# EAGLE design Schematic (EAGLE 9.4.2)

## Sheet 1 of 3: Power
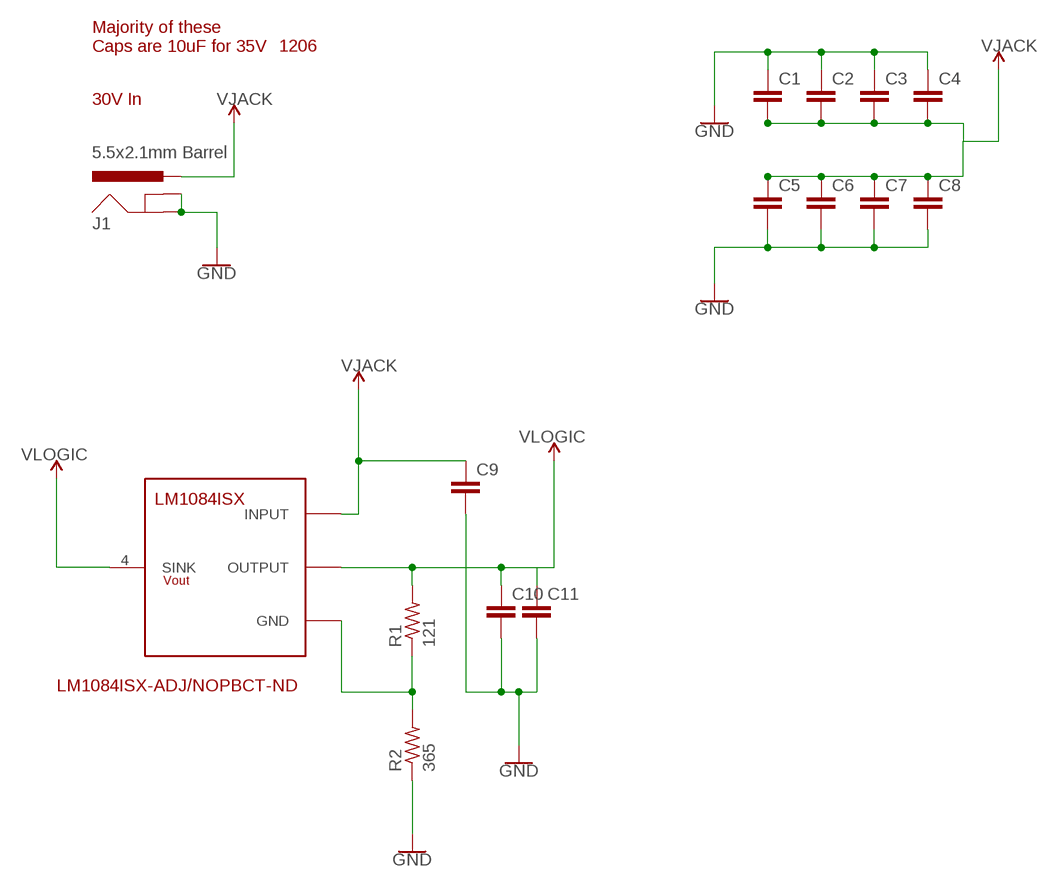
[diagram p0: schematic, sheet 1]

### Parts
C1  C-EUC1206K  [C1206K]
C2  C-EUC1206K  [C1206K]
C3  C-EUC1206K  [C1206K]
C4  C-EUC1206K  [C1206K]
C5  C-EUC1206K  [C1206K]
C6  C-EUC1206K  [C1206K]
C7  C-EUC1206K  [C1206K]
C8  C-EUC1206K  [C1206K]
C9  C-EUC1206K  [C1206K]
C10  C-EUC1206K  [C1206K]
C11  C-EUC1206K  [C1206K]
J1  5.5x2.1mm Barrel  POWER_JACKSMD  [POWER_JACK_SMD]
R1  121  R-US_R0805  [R0805]
R2  365  R-US_R0805  [R0805]
U$2  LM1084ISX  [TO254P1435X464-4N]

### Nets
GND: C1.1 C2.1 C3.1 C4.1 C5.2 C6.2 C7.2 C8.2 C9.2 C10.2 C11.2 J1.GND(GNDBREAK) J1.P$4(GND) R2.1 ; also sheet 2,3
N$1: R1.1 R2.2 U$2.1(GND)
VJACK: C1.2 C2.2 C3.2 C4.2 C5.1 C6.1 C7.1 C8.1 C9.1 J1.VIN0(PWR) U$2.3(INPUT) ; supply symbol labelled VCC ; also sheet 3
VLOGIC: C10.1 C11.1 R1.2 U$2.2(OUTPUT) U$2.4(SINK) ; supply symbol labelled VCC ; also sheet 2,3

### Notes on the sheet
- Majority of these
  Caps are 10uF for 35V
- 1206
- 30V In
- LM1084ISX-ADJ/NOPBCT-ND

## Sheet 2 of 3: Logic
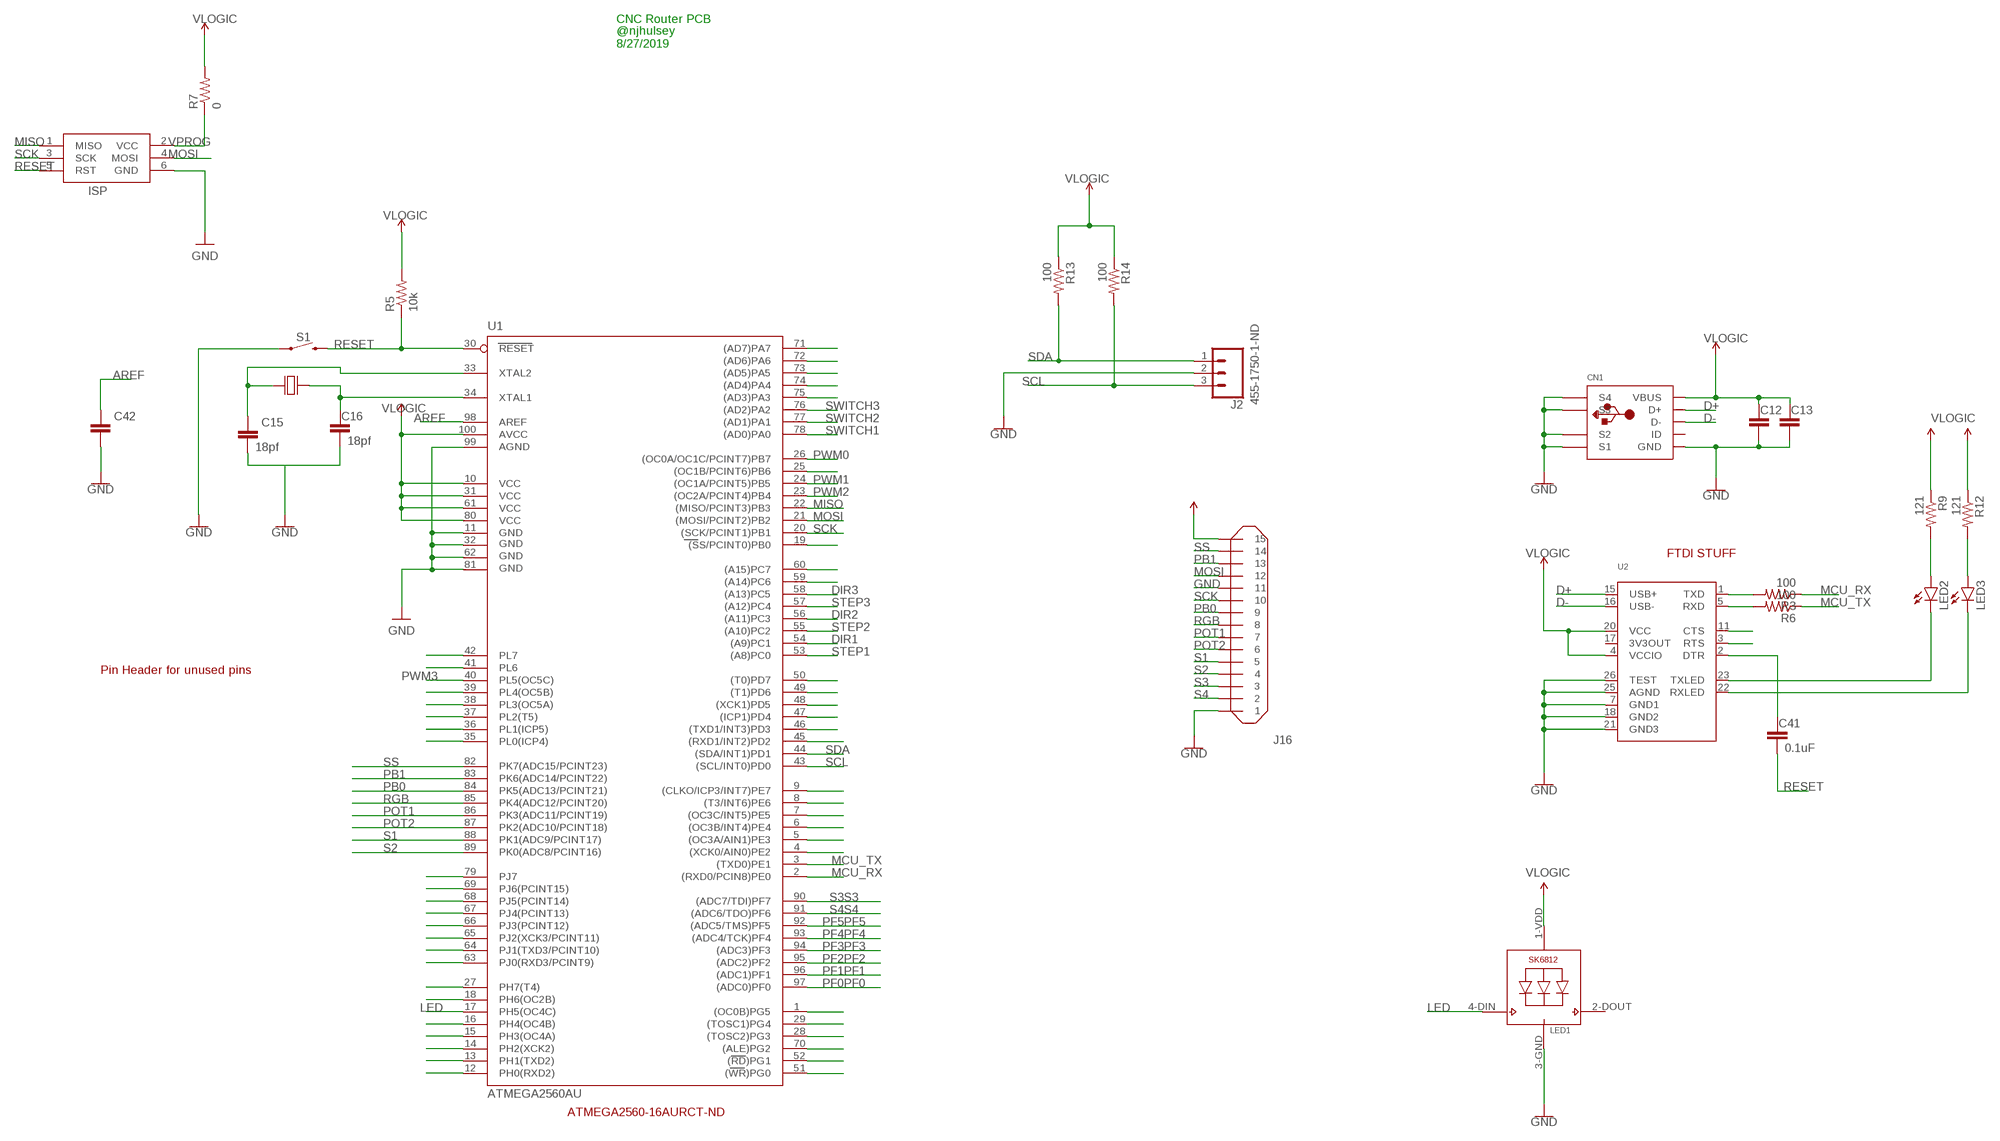
[diagram p1: schematic, sheet 2]

### Parts
C12  C-EUC0805  [C0805]
C13  C-EUC0805  [C0805]
C15  18pf  C-EUC0805  [C0805]
C16  18pf  C-EUC0805  [C0805]
C41  0.1uF  C-EUC0805  [C0805]
C42  C-EUC0805  [C0805]
CN1  USBMINIBLARGE  [USB-MINIB_LARGER]
ISP  AVRISP-6  [AVRISP]
J2  455-1750-1-ND  CONN_03  [1X03]
J16  MOLEX-15-FFC-VERT  [MOLEX-VERT-FFC-15]
LED1  SK6812_5050  [LED5050]
LED2  LEDCHIPLED_0805  [CHIPLED_0805]
LED3  LEDCHIPLED_0805  [CHIPLED_0805]
R3  100  R-US_R0805  [R0805]
R5  10k  R-US_R0805  [R0805]
R6  100  R-US_R0805  [R0805]
R7  0  R-US_R0805  [R0805]
R9  121  R-US_R0805  [R0805]
R12  121  R-US_R0805  [R0805]
R13  100  R-US_R0805  [R0805]
R14  100  R-US_R0805  [R0805]
S1  MOMENTARY-SWITCH-SPST-SMD-5.2-REDUNDANT  [TACTILE_SWITCH_SMD_5.2MM]
U1  ATMEGA2560AU  [TQFP100]
U2  FT232RLSSOP28  [SSOP28DB]
U$1  CRYSTAL-SMD-HC-49US  [CRYSTAL_SMD_HC-49/US]

### Nets
AREF: C42.1 U1.98(AREF)
D+: CN1.D+ U2.15(USB+)
D-: CN1.D- U2.16(USB-)
DIR1: U1.54((A9)PC1) ; also sheet 3
DIR2: U1.56((A11)PC3) ; also sheet 3
DIR3: U1.58((A13)PC5) ; also sheet 3
GND: C12.2 C13.2 C15.2 C16.2 C42.2 CN1.GND CN1.GND1(S1) CN1.GND2(S2) CN1.GND3(S3) CN1.GND4(S4) ISP.6(GND) J2.2 J16.P$1 J16.P$2 J16.P$21 J16.P$22 LED1.3-GND(GND) S1.1 S1.2 U1.11(GND) U1.32(GND1) U1.62(GND2) U1.81(GND3) U1.99(AGND) U2.7(GND1) U2.18(GND2) U2.21(GND3) U2.25(AGND) U2.26(TEST) ; also sheet 1,3
LED: LED1.4-DIN(DI) U1.17(PH5(OC4C))
MCU_RX: R3.1 U1.2((RXD0/PCIN8)PE0)
MCU_TX: R6.1 U1.3((TXD0)PE1)
MISO: ISP.1(MISO) U1.22((MISO/PCINT3)PB3)
MOSI: ISP.4(MOSI) J16.P$23 J16.P$24 U1.21((MOSI/PCINT2)PB2)
N$2: LED2.A R9.2
N$5: U1.5((OC3A/AIN1)PE3)
N$6: LED3.A R12.2
N$7: U1.45((RXD1/INT2)PD2)
N$9: U1.46((TXD1/INT3)PD3)
N$10: R3.2 U2.1(TXD)
N$11: R6.2 U2.5(RXD)
N$12: U2.11(CTS)
N$13: U2.3(RTS)
N$14: C41.1 U2.2(DTR)
N$15: LED2.C U2.23(TXLED)
N$16: LED3.C U2.22(RXLED)
N$17: U1.79(PJ7)
N$91: C15.1 U1.33(XTAL2) U$1.P$2
N$92: C16.1 U1.34(XTAL1) U$1.P$1
N$93: U1.12(PH0(RXD2))
N$94: U1.13(PH1(TXD2))
N$95: U1.14(PH2(XCK2))
N$96: U1.15(PH3(OC4A))
N$97: U1.16(PH4(OC4B))
N$99: U1.18(PH6(OC2B))
N$100: U1.27(PH7(T4))
N$101: U1.63(PJ0(RXD3/PCINT9))
N$102: U1.64(PJ1(TXD3/PCINT10))
N$103: U1.65(PJ2(XCK3/PCINT11))
N$104: U1.66(PJ3(PCINT12))
N$105: U1.67(PJ4(PCINT13))
N$106: U1.68(PJ5(PCINT14))
N$107: U1.69(PJ6(PCINT15))
N$117: U1.35(PL0(ICP4))
N$118: U1.36(PL1(ICP5))
N$119: U1.37(PL2(T5))
N$120: U1.38(PL3(OC5A))
N$121: U1.39(PL4(OC5B))
N$123: U1.41(PL6)
N$124: U1.42(PL7)
N$125: U1.71((AD7)PA7)
N$126: U1.72((AD6)PA6)
N$127: U1.73((AD5)PA5)
N$128: U1.74((AD4)PA4)
N$129: U1.75((AD3)PA3)
N$134: U1.25((OC1B/PCINT6)PB6)
N$137: U1.19((SS/PCINT0)PB0)
N$138: U1.60((A15)PC7)
N$139: U1.59((A14)PC6)
N$146: U1.50((T0)PD7)
N$147: U1.49((T1)PD6)
N$148: U1.48((XCK1)PD5)
N$149: U1.47((ICP1)PD4)
N$152: U1.9((CLKO/ICP3/INT7)PE7)
N$153: U1.8((T3/INT6)PE6)
N$154: U1.7((OC3C/INT5)PE5)
N$155: U1.6((OC3B/INT4)PE4)
N$157: U1.4((XCK0/AIN0)PE2)
N$168: U1.1((OC0B)PG5)
N$169: U1.29((TOSC1)PG4)
N$170: U1.28((TOSC2)PG3)
N$171: U1.70((ALE)PG2)
N$172: U1.52((RD)PG1)
N$173: U1.51((WR)PG0)
PB0: J16.P$17 J16.P$18 U1.84(PK5(ADC13/PCINT21))
PB1: J16.P$25 J16.P$26 U1.83(PK6(ADC14/PCINT22))
PF0: U1.97((ADC0)PF0)
PF1: U1.96((ADC1)PF1)
PF2: U1.95((ADC2)PF2)
PF3: U1.94((ADC3)PF3)
PF4: U1.93((ADC4/TCK)PF4)
PF5: U1.92((ADC5/TMS)PF5)
POT1: J16.P$13 J16.P$14 U1.86(PK3(ADC11/PCINT19))
POT2: J16.P$11 J16.P$12 U1.87(PK2(ADC10/PCINT18))
PWM0: U1.26((OC0A/OC1C/PCINT7)PB7) ; also sheet 3
PWM1: U1.24((OC1A/PCINT5)PB5) ; also sheet 3
PWM2: U1.23((OC2A/PCINT4)PB4) ; also sheet 3
PWM3: U1.40(PL5(OC5C)) ; also sheet 3
RESET: C41.2 ISP.5(RST) R5.1 S1.3 S1.4 U1.30(RESET)
RGB: J16.P$15 J16.P$16 U1.85(PK4(ADC12/PCINT20))
S1: J16.P$9 J16.P$10 U1.88(PK1(ADC9/PCINT17))
S2: J16.P$7 J16.P$8 U1.89(PK0(ADC8/PCINT16))
S3: J16.P$5 J16.P$6 U1.90((ADC7/TDI)PF7)
S4: J16.P$3 J16.P$4 U1.91((ADC6/TDO)PF6)
SCK: ISP.3(SCK) J16.P$19 J16.P$20 U1.20((SCK/PCINT1)PB1)
SCL: J2.3 R14.2 U1.43((SCL/INT0)PD0)
SDA: J2.1 R13.2 U1.44((SDA/INT1)PD1)
SS: J16.P$27 J16.P$28 U1.82(PK7(ADC15/PCINT23))
STEP1: U1.53((A8)PC0) ; also sheet 3
STEP2: U1.55((A10)PC2) ; also sheet 3
STEP3: U1.57((A12)PC4) ; also sheet 3
SWITCH1: U1.78((AD0)PA0) ; also sheet 3
SWITCH2: U1.77((AD1)PA1) ; also sheet 3
SWITCH3: U1.76((AD2)PA2) ; also sheet 3
VCC: J16.P$29 J16.P$30
VLOGIC: C12.1 C13.1 CN1.VBUS LED1.1-VDD(VDD) R5.2 R7.2 R9.1 R12.1 R13.1 R14.1 U1.10(VCC) U1.31(VCC1) U1.61(VCC2) U1.80(VCC3) U1.100(AVCC) U2.4(VCCIO) U2.20(VCC) ; supply symbol labelled VCC ; also sheet 1,3
VPROG: ISP.2(VCC) R7.1
Unconnected: CN1.ID LED1.2-DOUT(DO)

### Notes on the sheet
- CNC Router PCB
- @njhulsey
  8/27/2019
- FTDI STUFF
- Pin Header for unused pins
- ATMEGA2560-16AURCT-ND

## Sheet 3 of 3: Devices
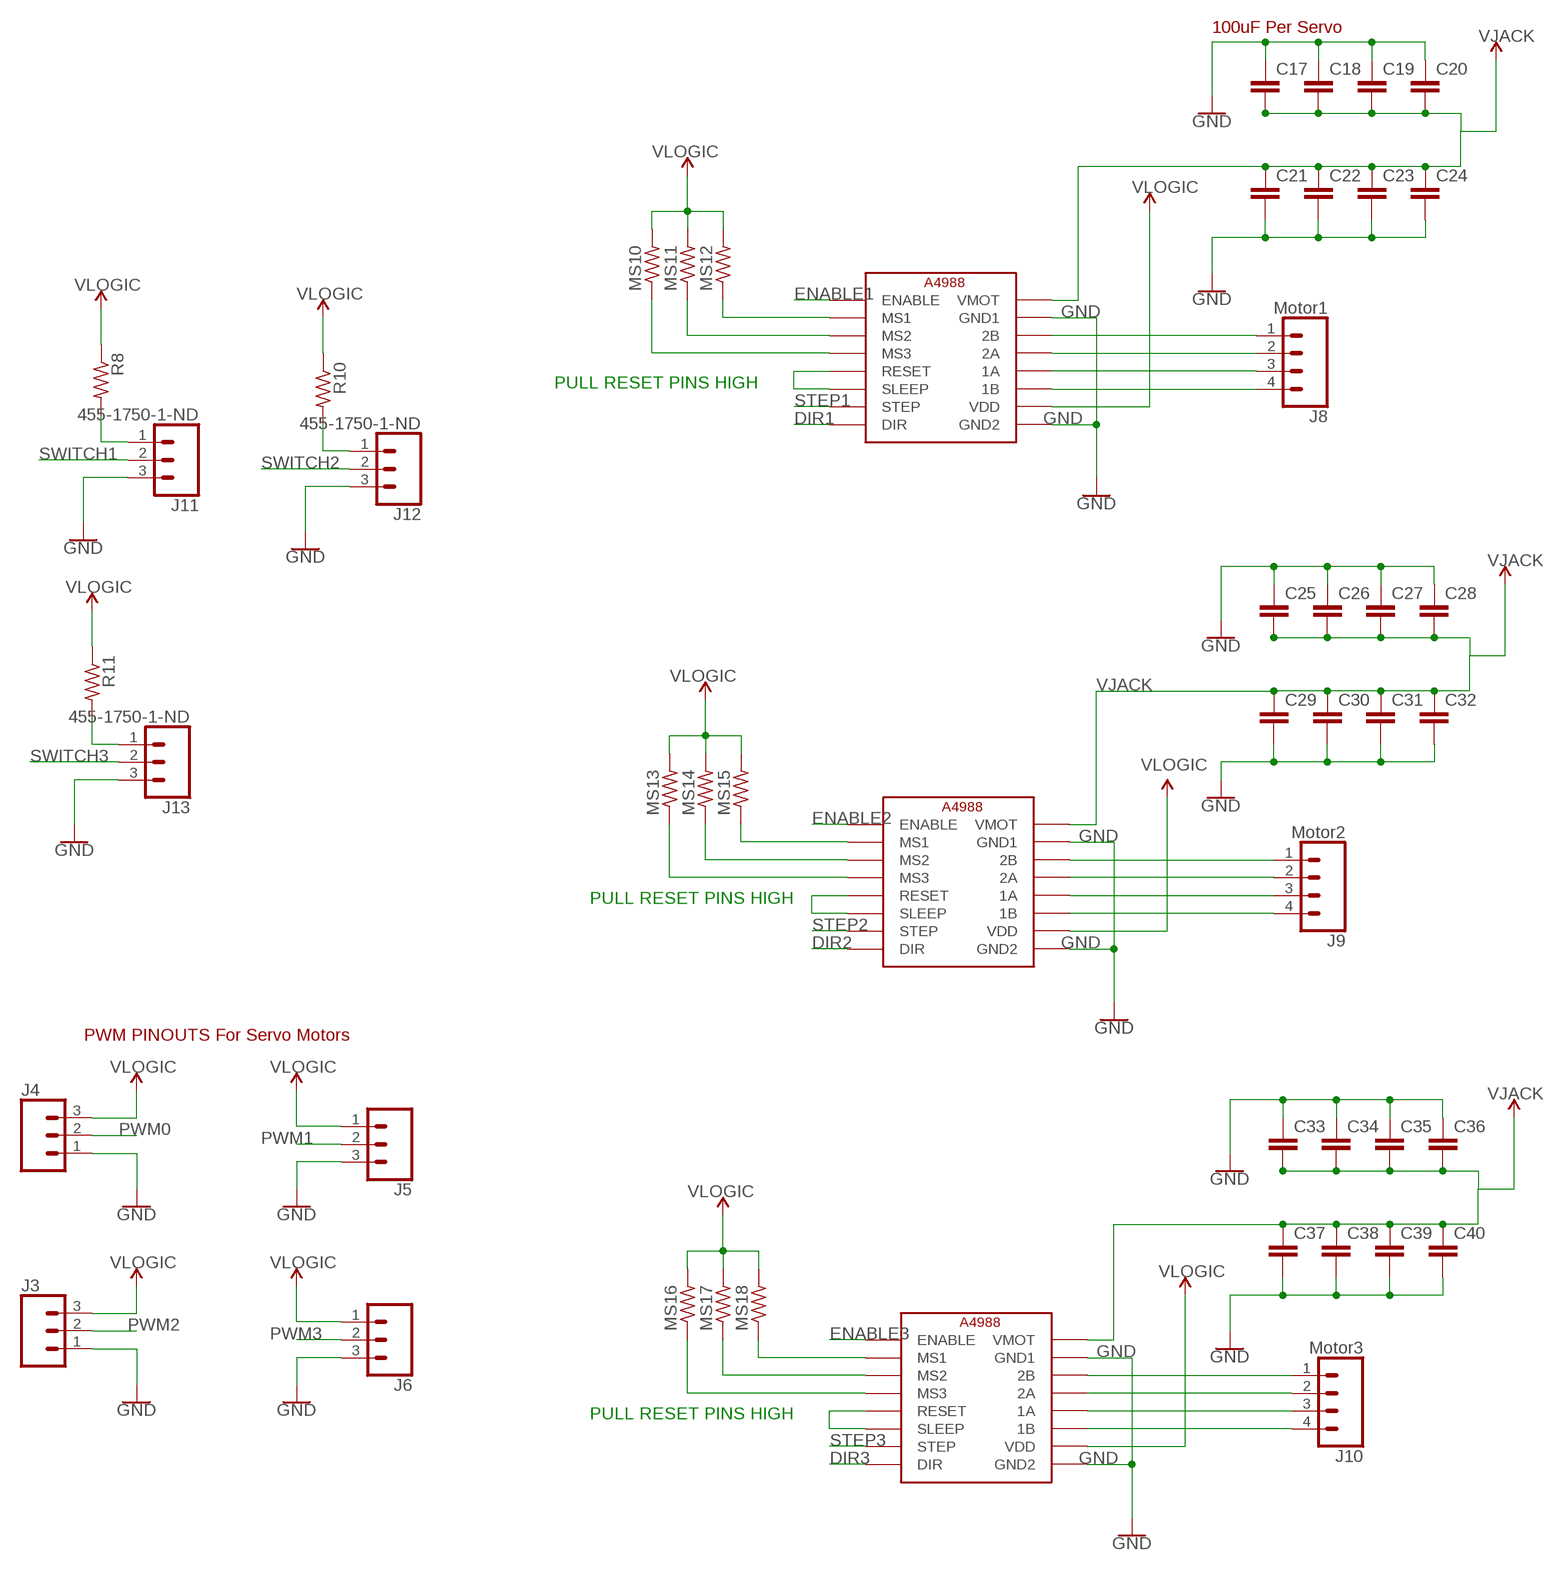
[diagram p2: schematic, sheet 3]

### Parts
C17  C-EUC1206K  [C1206K]
C18  C-EUC1206K  [C1206K]
C19  C-EUC1206K  [C1206K]
C20  C-EUC1206K  [C1206K]
C21  C-EUC1206K  [C1206K]
C22  C-EUC1206K  [C1206K]
C23  C-EUC1206K  [C1206K]
C24  C-EUC1206K  [C1206K]
C25  C-EUC1206K  [C1206K]
C26  C-EUC1206K  [C1206K]
C27  C-EUC1206K  [C1206K]
C28  C-EUC1206K  [C1206K]
C29  C-EUC1206K  [C1206K]
C30  C-EUC1206K  [C1206K]
C31  C-EUC1206K  [C1206K]
C32  C-EUC1206K  [C1206K]
C33  C-EUC1206K  [C1206K]
C34  C-EUC1206K  [C1206K]
C35  C-EUC1206K  [C1206K]
C36  C-EUC1206K  [C1206K]
C37  C-EUC1206K  [C1206K]
C38  C-EUC1206K  [C1206K]
C39  C-EUC1206K  [C1206K]
C40  C-EUC1206K  [C1206K]
DRVER_4  Driver1  A4988  [A4988]
DRVER_5  Driver1  A4988  [A4988]
DRVER_6  Driver1  A4988  [A4988]
J3  455-1750-1-ND  CONN_03  [1X03]
J4  455-1750-1-ND  CONN_03  [1X03]
J5  455-1750-1-ND  CONN_03  [1X03]
J6  455-1750-1-ND  CONN_03  [1X03]
J8  Motor1  CONN_04  [1X04]
J9  Motor2  CONN_04  [1X04]
J10  Motor3  CONN_04  [1X04]
J11  455-1750-1-ND  CONN_03  [1X03]
J12  455-1750-1-ND  CONN_03  [1X03]
J13  455-1750-1-ND  CONN_03  [1X03]
MS10  R-US_R0805  [R0805]
MS11  R-US_R0805  [R0805]
MS12  R-US_R0805  [R0805]
MS13  R-US_R0805  [R0805]
MS14  R-US_R0805  [R0805]
MS15  R-US_R0805  [R0805]
MS16  R-US_R0805  [R0805]
MS17  R-US_R0805  [R0805]
MS18  R-US_R0805  [R0805]
R8  R-US_R0805  [R0805]
R10  R-US_R0805  [R0805]
R11  R-US_R0805  [R0805]

### Nets
DIR1: DRVER_4.P$9(DIR) ; also sheet 2
DIR2: DRVER_5.P$9(DIR) ; also sheet 2
DIR3: DRVER_6.P$9(DIR) ; also sheet 2
ENABLE1: DRVER_4.P$16(ENABLE)
ENABLE2: DRVER_5.P$16(ENABLE)
ENABLE3: DRVER_6.P$16(ENABLE)
GND: C17.1 C18.1 C19.1 C20.1 C21.2 C22.2 C23.2 C24.2 C25.1 C26.1 C27.1 C28.1 C29.2 C30.2 C31.2 C32.2 C33.1 C34.1 C35.1 C36.1 C37.2 C38.2 C39.2 C40.2 DRVER_4.P$1(GND2) DRVER_4.P$7(GND1) DRVER_5.P$1(GND2) DRVER_5.P$7(GND1) DRVER_6.P$1(GND2) DRVER_6.P$7(GND1) J3.1 J4.1 J5.3 J6.3 J11.3 J12.3 J13.3 ; also sheet 1,2
N$3: J11.1 R8.2
N$4: J12.1 R10.2
N$8: J13.1 R11.2
N$18: DRVER_4.P$13(MS3) MS10.1
N$19: DRVER_4.P$14(MS2) MS11.1
N$20: DRVER_4.P$15(MS1) MS12.1
N$21: DRVER_4.P$3(1B) J8.4
N$22: DRVER_4.P$4(1A) J8.3
N$23: DRVER_4.P$5(2A) J8.2
N$24: DRVER_4.P$6(2B) J8.1
N$25: DRVER_6.P$13(MS3) MS16.1
N$26: DRVER_6.P$14(MS2) MS17.1
N$27: DRVER_6.P$15(MS1) MS18.1
N$28: DRVER_6.P$6(2B) J10.1
N$29: DRVER_6.P$5(2A) J10.2
N$30: DRVER_6.P$4(1A) J10.3
N$31: DRVER_6.P$3(1B) J10.4
N$32: DRVER_5.P$15(MS1) MS15.1
N$33: DRVER_5.P$14(MS2) MS14.1
N$34: DRVER_5.P$13(MS3) MS13.1
N$35: DRVER_5.P$6(2B) J9.1
N$36: DRVER_5.P$5(2A) J9.2
N$37: DRVER_5.P$4(1A) J9.3
N$38: DRVER_5.P$3(1B) J9.4
PWM0: J4.2 ; also sheet 2
PWM1: J5.2 ; also sheet 2
PWM2: J3.2 ; also sheet 2
PWM3: J6.2 ; also sheet 2
SLEEP3: DRVER_4.P$11(SLEEP) DRVER_4.P$12(RESET)
SLEEP4: DRVER_5.P$11(SLEEP) DRVER_5.P$12(RESET)
SLEEP5: DRVER_6.P$11(SLEEP) DRVER_6.P$12(RESET)
STEP1: DRVER_4.P$10(STEP) ; also sheet 2
STEP2: DRVER_5.P$10(STEP) ; also sheet 2
STEP3: DRVER_6.P$10(STEP) ; also sheet 2
SWITCH1: J11.2 ; also sheet 2
SWITCH2: J12.2 ; also sheet 2
SWITCH3: J13.2 ; also sheet 2
VJACK: C17.2 C18.2 C19.2 C20.2 C21.1 C22.1 C23.1 C24.1 C25.2 C26.2 C27.2 C28.2 C29.1 C30.1 C31.1 C32.1 C33.2 C34.2 C35.2 C36.2 C37.1 C38.1 C39.1 C40.1 DRVER_4.P$8(VMOT) DRVER_5.P$8(VMOT) DRVER_6.P$8(VMOT) ; supply symbol labelled VCC ; also sheet 1
VLOGIC: DRVER_4.P$2(VDD) DRVER_5.P$2(VDD) DRVER_6.P$2(VDD) J3.3 J4.3 J5.1 J6.1 MS10.2 MS11.2 MS12.2 MS13.2 MS14.2 MS15.2 MS16.2 MS17.2 MS18.2 R8.1 R10.1 R11.1 ; supply symbol labelled VCC ; also sheet 1,2

### Notes on the sheet
- 100uF Per Servo
- PULL RESET PINS HIGH
- PULL RESET PINS HIGH
- PWM PINOUTS For Servo Motors
- PULL RESET PINS HIGH

## Power pins joined to a net without a drawn wire
3V3OUT: U2.17(3V3OUT)

## Library data of the parts
C1-C13 C15-C42 = resistor:C-EU: CAPACITOR, European symbol
CN1 = microbuilder:USB: USB Connectors USBMINIB - Surface Mount Female Mini-B USB Connector 4UConnector: 06564
DRVER_4-DRVER_6 = Nick's Personal Part:A4988
ISP = adafruit:AVRISP: AVR ISP HEADER Standard 6 pin header for AVR programming
J1 = SparkFun-Connectors:POWER_JACK: Power Jack Connector This is the standard 5.5mm barrel jack for power. The PTH is the most common, proven, reliable, footprint. The Slot footprint only works if the mill layer is transmitted to the PCB fab house so be warned. Here are the connectors we sell at SparkFun: DC Barrel Power Jack/Connector <https://www.sparkfun.com/products/119> (PRT-00119) DC Barrel Power Jack/Connector (SMD) <https://www.sparkfun.com/products/12748> (PRT-12748) DC Barrel Jack Adapter - Breadboard Compatible <https://www.sparkfun.com/products/10811> (PRT-10811) It is used on this SparkFun product (and many, many others): SparkFun RedBoard - Programmed with Arduino <https://www.sparkfun.com/products/12757> (DEV-12757) Also, if you need a mating power supply or connector, please check these out: Wall Adapter Power Supply - 9VDC 650mA <https://www.sparkfun.com/products/298> (TOL-00298) DC Barrel Jack Adapter - Male <https://www.sparkfun.com/products/10287> (PRT-10287); PROD_ID: CONN-08106; SF_ID: PRT-12748
J2-J6 J11-J13 = SparkFun-Connectors:CONN_03: Multi connection point. Often used as Generic Header-pin footprint for 0.1 inch spaced/style header connections On any of the 0.1 inch spaced packages, you can populate with these: Break Away Headers - Straight <https://www.sparkfun.com/products/116> (PRT-00116) Break Away Male Headers - Right Angle <https://www.sparkfun.com/products/553> (PRT-00553) Female Headers <https://www.sparkfun.com/products/115> (PRT-00115) Break Away Headers - Machine Pin <https://www.sparkfun.com/products/117> (PRT-00117) Break Away Female Headers - Swiss Machine Pin <https://www.sparkfun.com/products/743> (PRT-00743) Stackable Header - 3 Pin (Female, 0.1") <https://www.sparkfun.com/products/13875> (PRT-13875) For SCREWTERMINALS and SPRING TERMINALS visit here: Screw Terimnals on SparkFun.com <https://www.sparkfun.com/search/results?term=Screw+Terminals> (5mm/3.5mm/2.54mm spacing) This device is also useful as a general connection point to wire up your design to another part of your project. Our various solder wires solder well into these plated through hole pads. Hook-Up Wire - Assortment (Stranded, 22 AWG) <https://www.sparkfun.com/products/11375> (PRT-11375) Hook-Up Wire - Assortment (Solid Core, 22 AWG) <https://www.sparkfun.com/products/11367> (PRT-11367) View the entire wire category on our website here <https://www.sparkfun.com/categories/141> Special notes: Molex polarized connector foot print use with SKU : PRT-08232 with associated crimp pins and housings.; PROD_ID: XXX-00000
J8-J10 = SparkFun-Connectors:CONN_04: Multi connection point. Often used as Generic Header-pin footprint for 0.1 inch spaced/style header connections On any of the 0.1 inch spaced packages, you can populate with these: Break Away Headers - Straight <https://www.sparkfun.com/products/116> (PRT-00116) Break Away Male Headers - Right Angle <https://www.sparkfun.com/products/553> (PRT-00553) Female Headers <https://www.sparkfun.com/products/115> (PRT-00115) Break Away Headers - Machine Pin <https://www.sparkfun.com/products/117> (PRT-00117) Break Away Female Headers - Swiss Machine Pin <https://www.sparkfun.com/products/743> (PRT-00743) For SCREWTERMINALS and SPRING TERMINALS visit here: Screw Terimnals on SparkFun.com <https://www.sparkfun.com/search/results?term=Screw+Terminals> (5mm/3.5mm/2.54mm spacing) This device is also useful as a general connection point to wire up your design to another part of your project. Our various solder wires solder well into these plated through hole pads. Hook-Up Wire - Assortment (Stranded, 22 AWG) <https://www.sparkfun.com/products/11375> (PRT-11375) Hook-Up Wire - Assortment (Solid Core, 22 AWG) <https://www.sparkfun.com/products/11367> (PRT-11367) View the entire wire category on our website here <https://www.sparkfun.com/categories/141> Special notes: Molex polarized connector foot print use with SKU : PRT-08231 with associated crimp pins and housings. 1MM SMD Version SKU: PRT-10208; PROD_ID: CONN-09696
J16 = Nick's Personal Part:MOLEX-15-FFC-VERT: 0526101572 - Molex Connector Technical Specifications: FFC Connector Pins: 15 Pitch: 1mm Type: Vertical Digikey: WM11008CT-ND Flex Cable: 100R15-152B
LED1 = SK6812:SK6812
LED2 LED3 = led:LED: LED OSRAM: - CHIPLED LG R971, LG N971, LY N971, LG Q971, LY Q971, LO R971, LY R971 LH N974, LH R974 LS Q976, LO Q976, LY Q976 LO Q996 - Hyper CHIPLED LW Q18S LB Q993, LB Q99A, LB R99A - SideLED LS A670, LO A670, LY A670, LG A670, LP A670 LB A673, LV A673, LT A673, LW A673 LH A674 LY A675 LS A676, LA A676, LO A676, LY A676, LW A676 LS A679, LY A679, LG A679 - Hyper Micro SIDELED® LS Y876, LA Y876, LO Y876, LY Y876 LT Y87S - SmartLED LW L88C, LW L88S LB L89C, LB L89S, LG L890 LS L89K, LO L89K, LY L89K LS L896, LA L896, LO L896, LY L896 - TOPLED LS T670, LO T670, LY T670, LG T670, LP T670 LSG T670, LSP T670, LSY T670, LOP T670, LYG T670 LG T671, LOG T671, LSG T671 LB T673, LV T673, LT T673, LW T673 LH T674 LS T676, LA T676, LO T676, LY T676, LB T676, LH T676, LSB T676, LW T676 LB T67C, LV T67C, LT T67C, LS T67K, LO T67K, LY T67K, LW E67C LS E67B, LA E67B, LO E67B, LY E67B, LB E67C, LV E67C, LT E67C LW T67C LS T679, LY T679, LG T679 LS T770, LO T770, LY T770, LG T770, LP T770 LB T773, LV T773, LT T773, LW T773 LH T774 LS E675, LA E675, LY E675, LS T675 LS T776, LA T776, LO T776, LY T776, LB T776 LHGB T686 LT T68C, LB T68C - Hyper Mini TOPLED® LB M676 - Mini TOPLED Santana® LG M470 LS M47K, LO M47K, LY M47K Source: http://www.osram.convergy.de LUXEON: - LUMILED® LXK2-PW12-R00, LXK2-PW12-S00, LXK2-PW14-U00, LXK2-PW14-V00 LXK2-PM12-R00, LXK2-PM12-S00, LXK2-PM14-U00 LXK2-PE12-Q00, LXK2-PE12-R00, LXK2-PE12-S00, LXK2-PE14-T00, LXK2-PE14-U00 LXK2-PB12-K00, LXK2-PB12-L00, LXK2-PB12-M00, LXK2-PB14-N00, LXK2-PB14-P00, LXK2-PB14-Q00 LXK2-PR12-L00, LXK2-PR12-M00, LXK2-PR14-Q00, LXK2-PR14-R00 LXK2-PD12-Q00, LXK2-PD12-R00, LXK2-PD12-S00 LXK2-PH12-R00, LXK2-PH12-S00 LXK2-PL12-P00, LXK2-PL12-Q00, LXK2-PL12-R00 Source: www.luxeon.com KINGBRIGHT: KA-3528ASYC Source: www.kingbright.com
MS10-MS18 R1-R3 R5-R14 = resistor:R-US_: RESISTOR, American symbol
S1 = SparkFun-Switches:MOMENTARY-SWITCH-SPST: Momentary Switch (Pushbutton) - SPST Normally-open (NO) SPST momentary switches (buttons, pushbuttons). Variants PTH-12MM - 12mm square, through-hole Momentary Pushbutton Switch - 12mm Square <https://www.sparkfun.com/products/9190> (COM-09190) PTH-6.0MM, PTH-6.0MM-KIT - 6.0mm square, through-hole Mini Pushbutton Switch <https://www.sparkfun.com/products/97> (COM-00097) KIT package intended for soldering kit's - only one side of pads' copper is exposed. PTH-RIGHT-ANGLE-KIT - Right-angle, through-hole Right Angle Tactile Button <https://www.sparkfun.com/products/10791> - Used on SparkFun BigTime Watch Kit <https://www.sparkfun.com/products/11734> SMD-12MM - 12mm square, surface-mount Tactile Button - SMD (12mm) <https://www.sparkfun.com/products/12993> (COM-12993) Used on SparkFun PicoBoard <https://www.sparkfun.com/products/11888> SMD-4.5MM - 4.5mm Square Trackball Switch Used on SparkFun Blackberry Trackballer Breakout <https://www.sparkfun.com/products/13169> SMD-4.6MMX2.8MM - 4.60mm x 2.80mm, surface mount Used on SparkFun SAMD21 Mini Breakout <https://www.sparkfun.com/products/13664> SMD-5.2MM, SMD-5.2-REDUNDANT - 5.2mm square, surface-mount Mini Pushbutton Switch - SMD <https://www.sparkfun.com/products/8720> (COM-08720) Used on Arduino Pro Mini <https://www.sparkfun.com/products/11114> REDUNDANT package connects both switch circuits together SMD-6.0X3.5MM - 6.0 x 3.5mm, surface mount Momentary Reset Switch SMD <https://www.sparkfun.com/products/8229> (COM-08229) SMD-6.2MM-TALL - 6.2mm square, surface mount Tactile Button - SMD (6mm) <https://www.sparkfun.com/products/12992> Used on SparkFun Digital Sandbox <https://www.sparkfun.com/products/12651> SMD-RIGHT-ANGLE - Right-angle, surface mount Used on SparkFun Block for Intel® Edison - Arduino <https://www.sparkfun.com/products/13036>; PROD_ID: SWCH-08247; SF_SKU: COM-08720
U1 = SparkFun-IC-Microcontroller:ATMEGA2560: Atmel 100-pin 8-bit uC 64/128/256 Kbytes FLASH 4 Kbytes EEPROM 8 Kbytes SRAM 86 General Purpose I/O pins 12-channels16-bit PWM 4 x Serial USARTs 16-channels 10-bit A/D SparkFun Products None.; PROD_ID: IC-10040
U2 = microbuilder:FT232RL: FTDI FT232RL USB TO RS232 Converter Digikey: 768-1007-1-ND
U$1 = Nick's Personal Part:CRYSTAL-SMD-HC-49US
U$2 = TO254P1435X464-4N:LM1084ISX

## Board
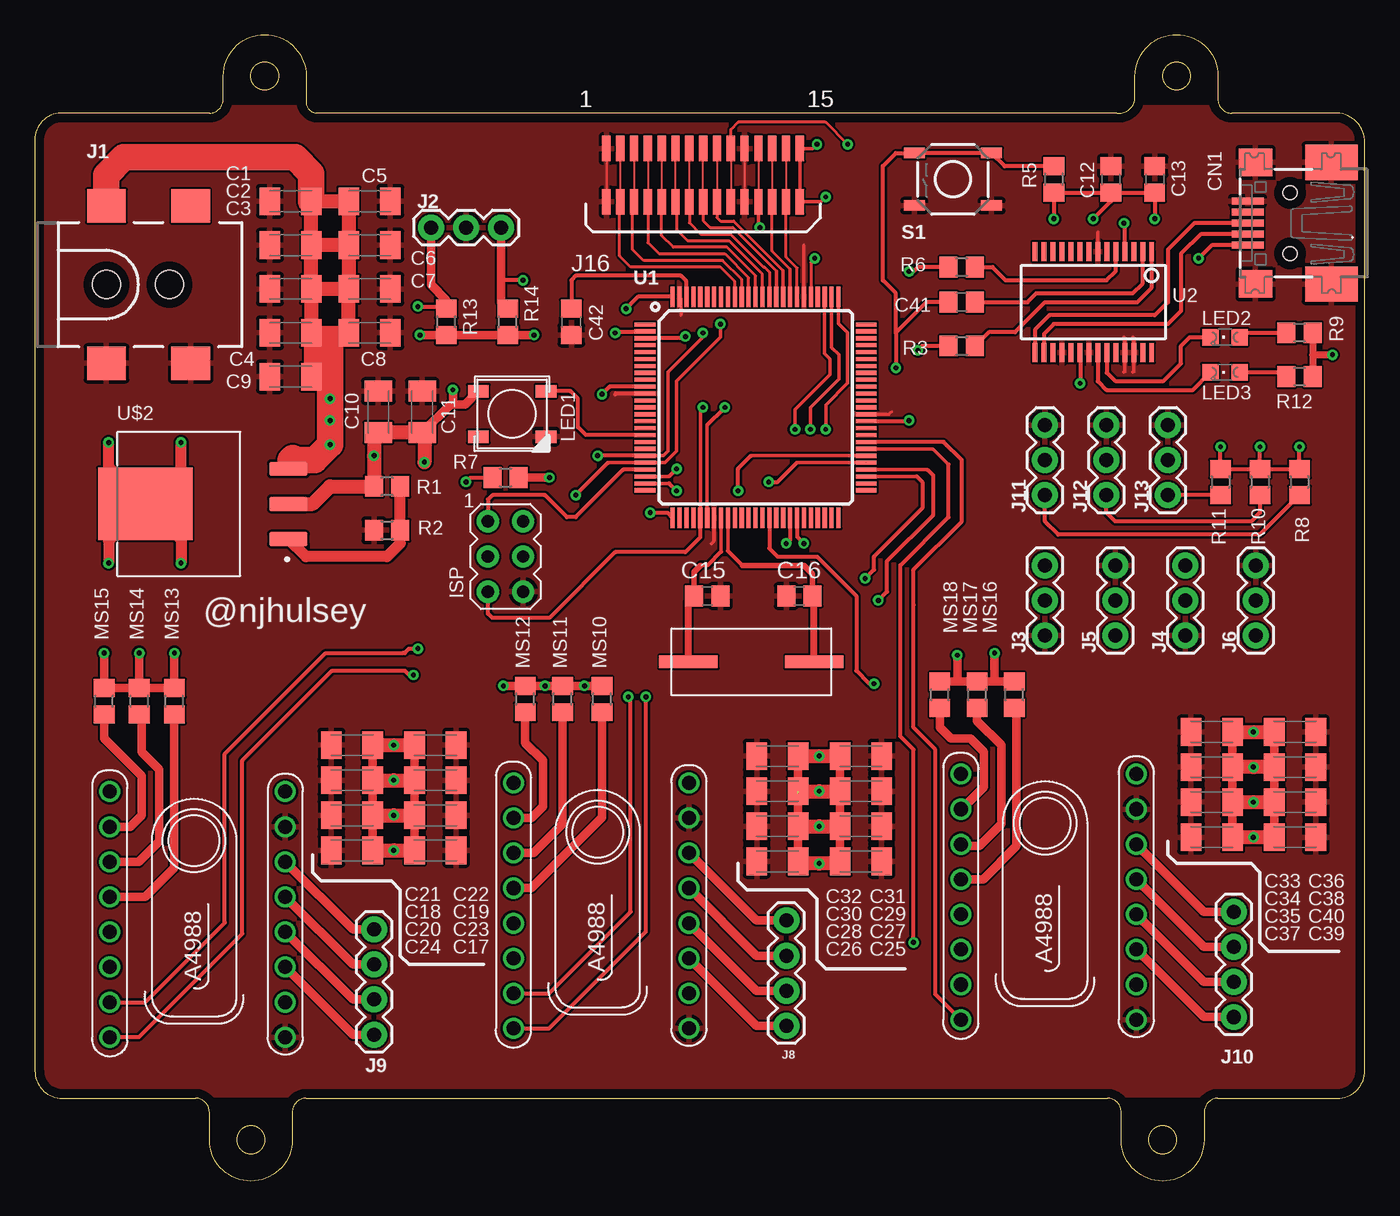
[diagram p3: board, top side]
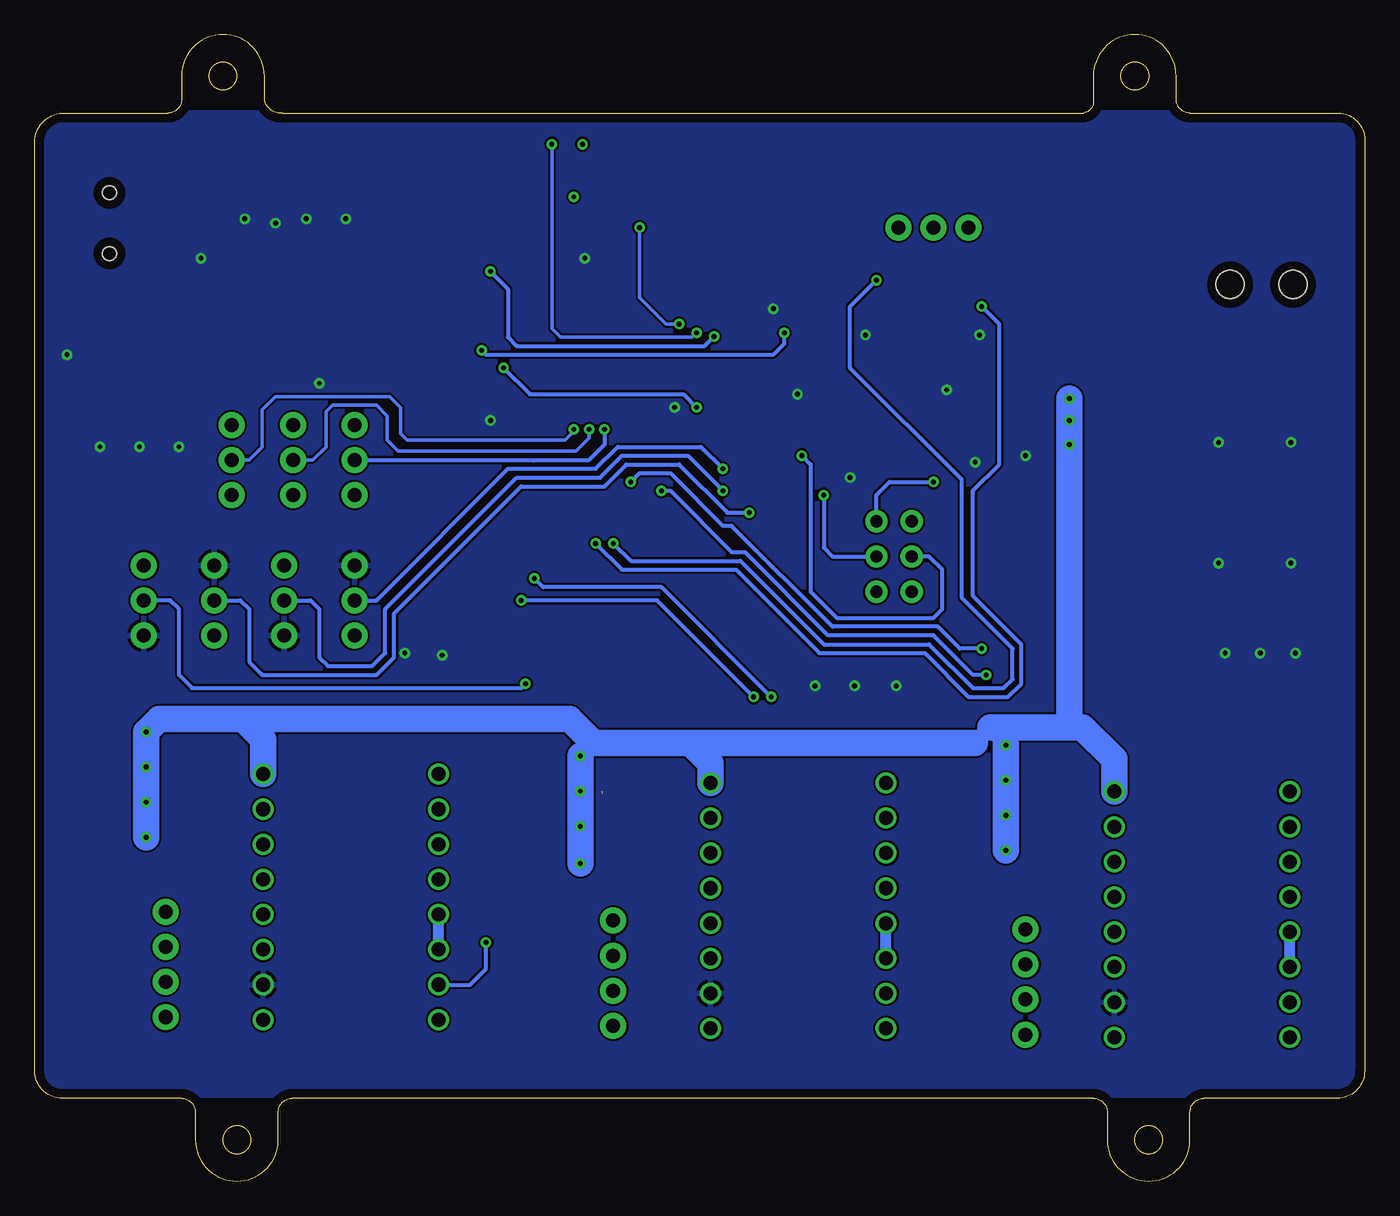
[diagram p4: board, bottom side, seen from below]

Size 96.3 x 83 mm. Coordinates in mm from the lower left corner, seen from the top.
Outline: 12.66,77.32 arc90 13.66,78.32 13.66,80 arc-90 16.66,83 arc-90 19.66,80 19.66,78.32 arc90 20.34,77.32 78.34,77.32 arc90 79.66,78.32 79.66,80 arc-90 82.66,83 arc-90 85.66,80 85.66,78.32 arc90 86.66,77.32 94.29,77.32 arc-90 96.29,75 96.29,8 arc-90 94.29,6 85.66,6 arc90 84.66,5 84.66,3 arc-90 81.66,0 arc-90 78.66,3 78.66,5 arc90 77.66,6 19.66,6 arc90 18.66,5 18.66,3 arc-90 15.66,0 arc-90 12.66,3 12.66,5 arc90 11.66,6 2.02,6 arc-90 0.02,8 0.02,75 arc-90 1.71,77.32 12.66,77.32
Outline: circle at 16.66,80 radius 1
Outline: circle at 82.66,80 radius 1
Outline: circle at 81.66,3 radius 1
Outline: circle at 15.66,3 radius 1
Copper layers (1*16): Top 0.035mm / dielectric 1.5mm / Bottom 0.035mm
Design rules "default *": minimum track width 6mil, minimum drill 0.35mm, track to track 6mil, track to pad 6mil, pad to pad 6mil, via to via 6mil, smd to smd 6mil, copper to edge 25mil, drill to drill 12mil, minimum pad ring 10mil, minimum via ring 8mil, stop-mask expansion 4mil, vias tented up to drill 0mil, thermal gap 10mil

### Footprints (pad centres in the part's own frame; a part is rotated, then mirrored left to right if it is on the bottom)
C1206K = smd 1.5 x 2: 1 -1.5,0; 2 1.5,0
C0805 = smd 1.3 x 1.5: 1 -0.95,0; 2 0.95,0
USB-MINIB_LARGER = smd 0.5 x 2.308: D+ 0,4.064; D- -0.8,4.064; GND 1.6,4.064; ID 0.8,4.064; VBUS -1.6,4.064 | smd 2.54 x 3.81: GND1 -4.4,-2; GND4 4.4,-2 | smd 2 x 2.4: GND2 -4.4,3.5; GND3 4.4,3.5 | hole 1: -2.2,1; 2.2,1
A4988 = drill 1.016: P$1 6.604,-8.128; P$2 6.604,-5.588; P$3 6.604,-3.048; P$4 6.604,-0.508; P$5 6.604,2.032; P$6 6.604,4.572; P$7 6.604,7.112; P$8 6.604,9.652; P$9 -6.096,-8.128; P$10 -6.096,-5.588; P$11 -6.096,-3.048; P$12 -6.096,-0.508; P$13 -6.096,2.032; P$14 -6.096,4.572; P$15 -6.096,7.112; P$16 -6.096,9.652
AVRISP = drill 0.9 pad 1.626: 1 -1.27,2.54; 2 1.27,2.54; 3 -1.27,0; 4 1.27,0; 5 -1.27,-2.54; 6 1.27,-2.54
POWER_JACK_SMD = smd 2.8 x 2.4: GND 0,-5.7; P$4 6.1,-5.7; VIN0 0,5.7; VIN1 6.1,5.7 | hole 2.032: 0,0; 4.572,0
1X03 = drill 1.016 pad 1.88: 1 0,0; 2 2.54,0; 3 5.08,0
1X04 = drill 1.016 pad 1.88: 1 0,0; 2 2.54,0; 3 5.08,0; 4 7.62,0
MOLEX-VERT-FFC-15 = smd 0.6 x 1.85: P$1 0,0; P$2 0,-3.85; P$3 1,0; P$4 1,-3.85; P$5 2,0; P$6 2,-3.85; P$7 3,0; P$8 3,-3.85; P$9 4,0; P$10 4,-3.85; P$11 5,0; P$12 5,-3.85; P$13 6,0; P$14 6,-3.85; P$15 7,0; P$16 7,-3.85; P$17 8,0; P$18 8,-3.85; P$19 9,0; P$20 9,-3.85; P$21 10,0; P$22 10,-3.85; P$23 11,0; P$24 11,-3.85; P$25 12,0; P$26 12,-3.85; P$27 13,0; P$28 13,-3.85; P$29 14,0; P$30 14,-3.85
LED5050 = smd 1.5 x 0.9: 1-VDD 2.45,-1.65; 2-DOUT 2.45,1.65; 3-GND -2.45,1.65; 4-DIN -2.45,-1.65
CHIPLED_0805 = smd 1.2 x 1.2: A 0,-1.05; C 0,1.05
R0805 = smd 1.3 x 1.5: 1 -0.95,0; 2 0.95,0
TACTILE_SWITCH_SMD_5.2MM = smd 1.524 x 0.762: 1 -2.794,1.905; 2 2.794,1.905; 3 -2.794,-1.905; 4 2.794,-1.905
TQFP100 = smd 1.5 x 0.3: 1 -8,6; 2 -8,5.5; 3 -8,5; 4 -8,4.5; 5 -8,4; 6 -8,3.5; 7 -8,3; 8 -8,2.5; 9 -8,2; 10 -8,1.5; 11 -8,1; 12 -8,0.5; 13 -8,0; 14 -8,-0.5; 15 -8,-1; 16 -8,-1.5; 17 -8,-2; 18 -8,-2.5; 19 -8,-3; 20 -8,-3.5; 21 -8,-4; 22 -8,-4.5; 23 -8,-5; 24 -8,-5.5; 25 -8,-6; 51 8,-6; 52 8,-5.5; 53 8,-5; 54 8,-4.5; 55 8,-4; 56 8,-3.5; 57 8,-3; 58 8,-2.5; 59 8,-2; 60 8,-1.5; 61 8,-1; 62 8,-0.5; 63 8,0; 64 8,0.5; 65 8,1; 66 8,1.5; 67 8,2; 68 8,2.5; 69 8,3; 70 8,3.5; 71 8,4; 72 8,4.5; 73 8,5; 74 8,5.5; 75 8,6 | smd 0.3 x 1.5: 26 -6,-8; 27 -5.5,-8; 28 -5,-8; 29 -4.5,-8; 30 -4,-8; 31 -3.5,-8; 32 -3,-8; 33 -2.5,-8; 34 -2,-8; 35 -1.5,-8; 36 -1,-8; 37 -0.5,-8; 38 0,-8; 39 0.5,-8; 40 1,-8; 41 1.5,-8; 42 2,-8; 43 2.5,-8; 44 3,-8; 45 3.5,-8; 46 4,-8; 47 4.5,-8; 48 5,-8; 49 5.5,-8; 50 6,-8; 76 6,8; 77 5.5,8; 78 5,8; 79 4.5,8; 80 4,8; 81 3.5,8; 82 3,8; 83 2.5,8; 84 2,8; 85 1.5,8; 86 1,8; 87 0.5,8; 88 0,8; 89 -0.5,8; 90 -1,8; 91 -1.5,8; 92 -2,8; 93 -2.5,8; 94 -3,8; 95 -3.5,8; 96 -4,8; 97 -4.5,8; 98 -5,8; 99 -5.5,8; 100 -6,8
SSOP28DB = smd 0.348 x 1.397: 1 -4.225,-3.656; 2 -3.575,-3.656; 3 -2.925,-3.656; 4 -2.275,-3.656; 5 -1.625,-3.656; 6 -0.975,-3.656; 7 -0.325,-3.656; 8 0.325,-3.656; 9 0.975,-3.656; 10 1.625,-3.656; 11 2.275,-3.656; 12 2.925,-3.656; 13 3.575,-3.656; 14 4.225,-3.656; 15 4.225,3.656; 16 3.575,3.656; 17 2.925,3.656; 18 2.275,3.656; 19 1.625,3.656; 20 0.975,3.656; 21 0.325,3.656; 22 -0.325,3.656; 23 -0.975,3.656; 24 -1.625,3.656; 25 -2.275,3.656; 26 -2.925,3.656; 27 -3.575,3.656; 28 -4.225,3.656
CRYSTAL_SMD_HC-49/US = smd 4.22 x 0.9: P$1 2.11,0; P$2 11.21,0
TO254P1435X464-4N = smd 1.05 x 2.79: 1 -2.54,-6.19; 2 0,-6.19; 3 2.54,-6.19 | smd 5.25 x 6.84: 4 0,4.16

### Placement (x,y rotation side)
C1  18.53,70.93 0 top
C2  18.53,67.76 0 top
C3  18.53,64.58 0 top
C4  18.53,61.41 0 top
C5  24.25,70.93 0 top
C6  24.25,67.76 0 top
C7  24.25,64.58 0 top
C8  24.25,61.41 0 top
C9  18.53,58.23 180 top
C10  24.88,55.69 90 top
C11  28.06,55.69 90 top
C12  77.91,72.52 90 top
C13  81.08,72.52 90 top
C15  48.7,42.36 0 top
C16  55.36,42.36 180 top
C17  29.01,26.48 180 top
C18  22.98,29.02 0 top
C19  29.01,29.02 180 top
C20  22.98,26.48 0 top
C21  22.98,31.56 180 top
C22  29.01,31.56 0 top
C23  29.01,23.94 0 top
C24  22.98,23.94 180 top
C25  59.81,23.15 180 top
C26  53.78,23.15 0 top
C27  59.81,25.69 180 top
C28  53.78,25.69 0 top
C29  59.81,28.23 0 top
C30  53.78,28.23 180 top
C31  59.81,30.77 0 top
C32  53.78,30.77 180 top
C33  85.21,32.52 0 top
C34  85.21,29.98 0 top
C35  85.21,27.44 0 top
C36  91.24,32.52 180 top
C37  85.21,24.9 180 top
C38  91.24,29.98 0 top
C39  91.24,24.9 0 top
C40  91.24,27.44 0 top
C41  67.11,63.63 180 top
C42  38.85,62.2 270 top
CN1  91.88,69.34 90 top
DRVER_4  40.76,19.18 0 top
DRVER_5  11.55,18.55 0 top
DRVER_6  73.14,19.81 0 top
ISP  34.09,45.22 0 top
J1  5.2,64.9 0 top
J2  28.69,69.03 0 top
J3  73.14,39.5 90 top
J4  83.3,39.5 90 top
J5  78.22,39.5 90 top
J6  88.38,39.5 90 top
J8  54.41,18.86 270 top
J9  24.57,18.23 270 top
J10  86.8,19.5 270 top
J11  73.14,49.66 90 top
J12  77.59,49.66 90 top
J13  82.03,49.66 90 top
J16  41.39,74.74 0 top
LED1  34.57,55.53 180 top
LED2  86.16,61.09 90 top
LED3  86.16,58.55 90 top
MS10  41.08,34.9 90 top
MS11  38.22,34.9 90 top
MS12  35.52,34.9 90 top
MS13  10.12,34.74 90 top
MS14  7.58,34.74 90 top
MS15  5.04,34.74 90 top
MS16  70.92,35.21 90 top
MS17  68.22,35.21 90 top
MS18  65.52,35.21 90 top
R1  25.52,50.3 180 top
R2  25.52,47.12 0 top
R3  67.11,60.45 0 top
R5  73.78,72.52 270 top
R6  67.11,66.17 0 top
R7  34.09,50.93 0 top
R8  91.56,50.61 270 top
R9  91.56,61.41 180 top
R10  88.7,50.61 270 top
R11  85.84,50.61 270 top
R12  91.56,58.23 180 top
R13  29.81,62.2 90 top
R14  34.25,62.2 90 top
S1  66.48,72.52 180 top
U1  52.19,56.01 0 top
U2  76.64,63.63 180 top
U$1  58.54,37.59 180 top
U$2  12.18,49.03 90 top

### Tracks (layer width: path | path; a pad name or v marks a point on that pad's centre or on a via)
AREF
  Top 0.305: U1.98 47.19,65.14 46.79,65.53 39.17,65.53 38.85,65.22 C42.1
D+
  Top 0.305: CN1.D+ 83.94,69.34 82.03,67.44 82.03,63.63 81.08,62.68 73.46,62.68 72.41,61.63 U2.15
D-
  Top 0.305: CN1.D- 84.41,68.55 82.99,67.12 82.99,63 82.03,62.04 73.78,62.04 73.06,61.33 U2.16
DIR1  (via drill 0.35)
  Top 0.254: U1.54 64.63,51.51
  Top 0.305: DRVER_4.P$9 37.24,11.05 44.25,18.07 v44.25,35.05 | v61.08,42.04 61.71,42.67 61.71,44.9 65.05,48.23 65.05,51.09 64.63,51.51
  Bottom 0.305: v44.25,35.05 51.24,42.04 v61.08,42.04
DIR2  (via drill 0.35)
  Top 0.254: 51.87,52.52 U1.56
  Top 0.305: DRVER_5.P$9 7.55,10.42 15.04,17.91 15.04,30.45 21.55,36.96 26.63,36.96 26.79,36.96 27.11,36.64 v27.42,36.64 | v50.92,49.98 50.92,51.56 51.87,52.52 | U1.56
  Bottom 0.305: v27.42,36.64 28.38,36.64 31.23,39.5 38.85,39.5 44.89,45.53 45.84,45.53 50.28,49.98 v50.92,49.98
DIR3
  Top 0.305: DRVER_6.P$9 65.21,13.53 65.21,31.24 63.62,32.83 63.62,41.72 63.62,44.26 67.11,47.75 67.11,52.2 65.8,53.51 U1.58
GND
  Top 0.152: J16.P$1 J16.P$2 | J16.P$21 J16.P$22
  Top 0.203: U1.81 55.69,67.75 55.68,67.76 | U1.62 61.85,55.51 62.03,55.69 | U1.99 46.78,63.92 46.78,63.16 46.79,63.15 46.79,62.68
  Top 0.254: 78.86,61.09 78.91,61.04 U2.25 78.91,58.6 78.86,58.55 | 79.49,61.09 79.56,61.02 U2.26 79.56,58.62 79.49,58.55 | U2.7 76.95,68.71 | U1.99 46.67,64.03 | U1.32 49.19,46.34 49.01,46.17
  Top 0.305: U1.11 42.08,57.01 42.03,56.96
  pour Top: -0.36,6.26 -0.36,77.71 97.69,77.71 97.69,6.26
LED
  Top 0.305: U1.17 39.9,54.01 39.33,54.58 39.33,56.64 38.79,57.18 LED1.4-DIN
MCU_RX  (via drill 0.35)
  Top 0.305: R3.1 64.25,60.45 v63.94,60.14 | v42.03,61.41 42.13,61.51 U1.2
  Bottom 0.305: v63.94,60.14 63.62,59.82 42.82,59.82 42.03,60.61 v42.03,61.41
MCU_TX  (via drill 0.35)
  Top 0.305: R6.1 63.94,66.17 63.62,65.85 v63.3,65.85 | v47.11,61.14 46.98,61.01 U1.3
  Bottom 0.305: v63.3,65.85 62.03,64.58 62.03,61.09 61.4,60.45 47.79,60.45 v47.11,61.14
MISO
  Top 0.305: U1.22 42.61,51.51 39.17,48.07 38.54,48.07 36.95,49.66 33.14,49.66 32.82,49.34 ISP.1
MOSI  (via drill 0.35)
  Top 0.152: J16.P$23 J16.P$24
  Top 0.254: 41.52,52.01 U1.21 45.65,52.01 46.47,52.83 46.47,57.92 49.65,61.09 v49.65,62.04 | J16.P$24 52.39,69.14 v52.51,69.03
  Top 0.305: 41.52,52.01 v39.17,49.66
  Bottom 0.254: v52.51,69.03 52.51,63.95 50.6,62.04 v49.65,62.04
  Bottom 0.305: v39.17,49.66 39.17,45.85 38.54,45.22 ISP.4
N$1
  Top 0.406: 26.47,46.17 R2.2
  Top 0.813: U$2.1 19.64,45.22 25.52,45.22 26.47,46.17 | R2.2 R1.1
N$2
  Top 0.305: LED2.A 87.53,61.41 R9.2
N$3
  Top 0.305: R8.2 88.7,46.8 74.1,46.8 73.14,47.75 J11.1
N$4
  Top 0.305: R10.2 88.7,48.39 88.07,47.75 78.22,47.75 77.59,48.39 J12.1
N$6
  Top 0.305: LED3.A 90.29,58.55 R12.2
N$8
  Top 0.305: R11.2 J13.1
N$10
  Top 0.305: R3.2 69.06,61.45 70.97,61.45 73.14,63.63 79.81,63.63 80.86,64.68 U2.1
N$11
  Top 0.305: R6.2 69.33,66.17 70.29,65.22 77.59,65.22 78.26,65.89 U2.5
N$14
  Top 0.305: C41.1 71.87,63.63 72.51,64.27 79.49,64.27 80.21,64.98 U2.2
N$15
  Top 0.305: U2.23 77.61,58.53 78.22,57.92 81.72,57.92 82.99,59.19 82.99,60.45 83.62,61.09 LED2.C
N$16
  Top 0.305: U2.22 76.96,57.91 77.59,57.28 83.84,57.28 LED3.C
N$18
  Top 0.61: MS10.1 41.08,26.32 35.97,21.21 DRVER_4.P$13
N$19
  Top 0.61: MS11.1 38.22,25.85 36.12,23.75 DRVER_4.P$14
N$20
  Top 0.61: MS12.1 35.52,31.72 36.79,30.45 36.79,27.12 35.97,26.29 DRVER_4.P$15
N$21
  Top 0.61: J8.4 52.25,11.24 DRVER_4.P$3
N$22
  Top 0.61: J8.3 52.25,13.78 DRVER_4.P$4
N$23
  Top 0.61: J8.2 52.25,16.32 DRVER_4.P$5
N$24
  Top 0.61: J8.1 52.25,18.86 DRVER_4.P$6
N$25
  Top 0.61: MS16.1 71.08,34.1 71.08,24.26 68.67,21.85 DRVER_6.P$13
N$26
  Top 0.305: 67.18,24.26 DRVER_6.P$14
  Top 0.61: MS17.1 68.22,33.31 69.97,31.56 69.97,25.85 68.38,24.26 67.18,24.26
N$27
  Top 0.305: DRVER_6.P$15 67.08,26.93
  Top 0.61: 67.08,26.93 68.7,28.55 68.7,31.09 67.75,32.04 66.32,32.04 65.52,32.83 MS18.1
N$28
  Top 0.61: J10.1 84.64,19.5 DRVER_6.P$6
N$29
  Top 0.61: J10.2 84.64,16.96 DRVER_6.P$5
N$30
  Top 0.61: J10.3 84.64,14.42 DRVER_6.P$4
N$31
  Top 0.61: J10.4 84.64,11.88 DRVER_6.P$3
N$32
  Top 0.61: MS15.1 5.04,32.04 7.74,29.34 7.74,26.48 6.91,25.66 DRVER_5.P$15
N$33
  Top 0.61: MS14.1 7.74,33.63 7.74,31.09 9.01,29.82 9.01,24.58 7.55,23.12 DRVER_5.P$14
N$34
  Top 0.61: MS13.1 10.12,22.67 8.03,20.58 DRVER_5.P$13
N$35
  Top 0.61: J9.1 23.04,18.23 DRVER_5.P$6
N$36
  Top 0.61: J9.2 23.04,15.69 DRVER_5.P$5
N$37
  Top 0.61: J9.3 23.04,13.15 DRVER_5.P$4
N$38
  Top 0.61: J9.4 23.04,10.61 DRVER_5.P$3
N$91
  Top 0.254: U1.33 49.69,45.57
  Top 0.305: 47.33,41.94 C15.1 | 49.69,45.57 48.7,44.58 48.22,44.58
  Top 0.406: 48.22,44.58 47.75,44.11 C15.1
  Top 0.508: U$1.P$2 47.33,41.94
N$92
  Top 0.254: 50.19,45.63 U1.34
  Top 0.305: 56.43,42.24 C16.1 | 51.24,44.58 50.19,45.63
  Top 0.406: C16.1 56.31,43.95 55.68,44.58 51.24,44.58
  Top 0.508: U$1.P$1 56.43,42.24
PB0
  Top 0.152: J16.P$17 J16.P$18
  Top 0.203: J16.P$18 49.39,69.76 49.65,69.5 50.6,69.5 54.19,65.92
  Top 0.254: 54.19,65.92 U1.84
PB1
  Top 0.152: J16.P$25 J16.P$26
  Top 0.203: J16.P$26 53.39,67.32 54.69,66.03
  Top 0.254: U1.83 54.69,66.03
POT1
  Top 0.152: J16.P$14 J16.P$13
  Top 0.203: J16.P$14 47.39,69.38 48.22,68.55 50.38,68.55 52.76,66.17 52.82,66.17 53.19,65.81 U1.86
POT2
  Top 0.152: J16.P$12 J16.P$11
  Top 0.203: 46.47,70.81 46.47,68.87 47.27,68.08 50.28,68.08 52.69,65.67 U1.87
  Top 0.254: J16.P$12 46.47,70.81
PWM0  (via drill 0.35)
  Top 0.305: v44.57,48.39 45.81,48.39 U1.26
  Bottom 0.305: J4.2 81.4,42.04 80.76,41.41 80.76,37.59 79.81,36.64 71.56,36.64 70.29,37.91 70.29,41.09 61.08,50.3 55.05,50.3 53.46,51.88 49.65,51.88 46.16,48.39 v44.57,48.39
PWM1  (via drill 0.35)
  Top 0.254: 45.94,50.51 U1.24
  Top 0.305: v46.47,49.98 45.94,50.51
  Bottom 0.305: J5.2 76.32,42.04 75.68,41.41 75.68,37.91 75.05,37.28 71.87,37.28 70.92,38.23 70.92,41.41 61.4,50.93 55.36,50.93 53.78,52.52 49.01,52.52 v46.47,49.98
PWM2  (via drill 0.35)
  Top 0.254: 45.92,51.01 U1.23
  Top 0.305: v46.47,51.56 45.92,51.01
  Bottom 0.305: v46.47,51.56 48.06,53.15 54.09,53.15 55.68,51.56 62.03,51.56 71.56,42.04 J3.2
PWM3  (via drill 0.35)
  Top 0.305: U1.40 53.19,45.8 53.78,45.22 56.63,45.22 59.49,42.36 59.49,36.96 60.44,36.01 v60.76,36.01
  Bottom 0.305: v60.76,36.01 61.08,35.69 84.89,35.69 85.84,36.64 85.84,41.41 86.48,42.04 J6.2
RESET  (via drill 0.35)
  Top 0.254: 48.19,55.82 U1.30
  Top 0.305: R5.1 70.23,73.47 S1.3 S1.4 62.35,74.42 61.4,73.47 61.4,65.22 62.35,64.27 62.35,61.41 | C41.2 64.57,63.63 62.35,61.41 | 62.35,61.41 v62.35,58.87 | U1.30 48.19,46.61 47.11,45.53 42.03,45.53 37.27,40.77 33.14,40.77 32.82,41.09 ISP.5 | v48.38,56.01 48.19,55.82
  Bottom 0.305: v62.35,58.87 60.44,56.96 49.33,56.96 v48.38,56.01
RGB
  Top 0.152: J16.P$16 J16.P$15
  Top 0.203: J16.P$16 48.39,69.53 48.89,69.03 50.54,69.03 53.69,65.88
  Top 0.254: 53.69,65.88 U1.85
S1
  Top 0.152: J16.P$9 J16.P$10
  Top 0.203: U1.88 52.19,65.53 50.13,67.6 46.25,67.6 45.39,68.45 J16.P$10
S2
  Top 0.152: J16.P$7 J16.P$8
  Top 0.203: U1.89 51.69,65.4 49.97,67.12 45.2,67.12 44.39,67.93 J16.P$8
S3
  Top 0.152: J16.P$5 J16.P$6
  Top 0.203: U1.90 51.19,65.27 49.81,66.65 44.09,66.65 43.3,67.44 43.3,70.8
  Top 0.254: 43.3,70.8 J16.P$6
S4
  Top 0.152: J16.P$3 J16.P$4
  Top 0.203: U1.91 50.69,65.13 49.65,66.17 43.14,66.17 42.35,66.96 42.35,70.84
  Top 0.254: 42.35,70.84 J16.P$4
SCK  (via drill 0.35)
  Top 0.152: J16.P$19 J16.P$20
  Top 0.203: J16.P$19 50.39,76.12 50.95,76.68 57.24,76.68 v58.86,75.06
  Top 0.254: v48.38,61.41 48.38,61.09 45.84,58.55 45.84,52.83 45.51,52.51 U1.20
  Top 0.305: U1.20 v40.77,52.51 v40.76,52.52
  Bottom 0.254: v58.86,75.06 58.86,61.72 58.22,61.09 48.7,61.09 v48.38,61.41
  Bottom 0.305: v40.76,52.52 40.12,51.88 40.12,42.67 38.22,40.77 31.23,40.77 30.6,41.41 30.6,44.26 31.55,45.22 ISP.3
SCL  (via drill 0.35)
  Top 0.305: U1.43 54.69,46.44 v54.41,46.17 | v35.36,65.22 33.77,65.22
  Top 0.61: J2.3 33.77,65.22 33.77,63.63 R14.2
  Bottom 0.305: v54.41,46.17 53.14,44.9 45.2,44.9 39.17,38.87 31.55,38.87 28.38,35.69 26.15,35.69 25.52,36.33 25.52,38.55 29.19,42.22 29.19,50.79 37.27,58.87 37.27,63.31 v35.36,65.22
SDA  (via drill 0.35)
  Top 0.305: U1.44 55.19,46.66 v55.68,46.17 | v27.74,63.31 29.64,63.31 R13.2
  Top 0.61: R13.2 29.81,63.79 28.69,64.9 J2.1
  Bottom 0.305: v55.68,46.17 53.78,44.26 45.52,44.26 39.49,38.23 31.87,38.23 28.69,35.05 25.84,35.05 24.88,36.01 24.88,38.87 28.38,42.36 28.38,49.98 26.47,51.88 26.47,62.04 v27.74,63.31
SLEEP3
  Bottom 0.813: DRVER_4.P$11 DRVER_4.P$12
SLEEP4
  Bottom 0.813: DRVER_5.P$11 DRVER_5.P$12
SLEEP5
  Bottom 0.813: DRVER_6.P$11 DRVER_6.P$12
SS
  Top 0.152: J16.P$27 J16.P$28
  Top 0.203: U1.82 55.19,66.1 54.39,66.9 J16.P$28
STEP1  (via drill 0.35)
  Top 0.254: U1.53 63.86,51.01
  Top 0.305: DRVER_4.P$10 37.24,13.59 43.14,19.5 43.14,34.9 v42.98,35.05 | v60.13,43.63 60.76,44.26 60.76,45.22 64.25,48.71 64.25,50.61 63.86,51.01
  Bottom 0.305: v42.98,35.05 50.92,42.99 59.49,42.99 v60.13,43.63
STEP2  (via drill 0.35)  (1 unrouted)
  Top 0.254: 55.18,52.01 U1.55
  Top 0.305: DRVER_5.P$10 8.03,12.96 13.77,18.7 13.77,30.93 21.07,38.23 26.63,38.23 26.79,38.23 27.11,38.55 v27.74,38.55 | 55.18,52.01 53.78,50.61 v53.14,50.61
  Bottom 0.305: v27.74,38.55 29.33,38.55 30.92,40.14 38.54,40.14 45.84,47.44 46.47,47.44 50.28,51.25 52.51,51.25 v53.14,50.61
STEP3  (via drill 0.35)
  Top 0.254: U1.57 65.03,53.01 66.16,51.88
  Top 0.305: v63.62,17.27 63.62,31.24 62.67,32.2 62.67,44.58 66.16,48.07 66.16,51.88
  Bottom 0.305: DRVER_6.P$10 64.76,14.23 63.62,15.37 v63.62,17.27
SWITCH1  (via drill 0.35)
  Top 0.254: U1.78 57.19,59.9 57.59,59.5 57.59,58.39 55.05,55.85 v55.05,54.42
  Bottom 0.305: J11.2 56.16,52.2 55.05,53.31 v55.05,54.42
SWITCH2  (via drill 0.35)
  Top 0.254: U1.77 57.69,60.35 58.22,59.82 58.22,58.07 56.16,56.01 v56.16,54.42
  Bottom 0.254: J12.2 76.16,52.2 75.21,53.15 75.21,55.69 74.73,56.17 71.56,56.17 70.76,55.38 70.76,53.63 69.97,52.83 57.11,52.83 56.16,53.79 v56.16,54.42
SWITCH3  (via drill 0.35)
  Top 0.254: v57.27,54.42 57.27,56.17 58.86,57.76 58.86,61.41 58.19,62.08 U1.76
  Bottom 0.254: J13.2 80.76,52.2 79.81,53.15 79.81,55.85 78.86,56.8 70.6,56.8 69.81,56.01 69.81,54.11 69.33,53.63 57.9,53.63 57.27,54.26 v57.27,54.42
VCC  (via drill 0.35)
  Top 0.254: v57.27,71.25 56.91,70.89 J16.P$30 J16.P$29 56.32,74.74 v56.63,75.06
VJACK  (via drill 0.35)  (1 unrouted)
  Top 0.254: C8.1 22.11,60.77 21.39,60.77 | U$2.3 18.14,51.8 18.69,52.36
  Top 0.61: C24.1 C20.2 C18.2 C21.1 | C22.1 C19.2 C17.2 C23.1 | 55.44,22.99 C26.2 55.28,25.44 55.52,25.69 C28.2 C30.1 C32.1 | 58.15,22.99 C25.2 C27.2 C29.1 C31.1 | 55.28,28 55.21,28.07 55.21,27.51 | C37.1 86.71,27.35 86.8,27.44 C35.2 C34.2 C33.2 | C36.2 C38.1 C40.1 C39.1
  Top 1.016: C18.2 v26,29.02 C19.2 | C20.2 v26,26.48 C17.2 | C24.1 v26,23.94 C23.1 | C21.1 v26,31.56 C22.1 | 55.44,22.99 v56.79,22.99 58.15,22.99 | 55.52,25.69 v56.79,25.69 C27.2 | C30.1 v56.79,28.23 C29.1 | C32.1 v56.79,30.77 C31.1 | C33.2 v88.23,32.52 C36.2 | C38.1 v88.23,29.98 C34.2 | 86.8,27.44 v88.23,27.44 C40.1 | C39.1 v88.23,24.9 C37.1 | C9.1 C4.2 | C4.2 C8.1 C7.1 | C7.1 C3.2 | C3.2 C4.2 | C3.2 C2.2 | C2.2 C1.2 C5.1 C6.1 | C6.1 C7.1 | C6.1 C2.2
  Top 1.905: J1.VIN0 5.2,72.84 6.47,74.11 18.85,74.11 20.03,72.92 C1.2 | 21.39,60.77 v21.39,56.64 v21.39,55.06 v21.39,53.31 20.28,52.2 18.53,52.2 18.69,52.36
  Bottom 0.254: 21.39,56.8 v21.39,56.64
  Bottom 1.016: v26,31.56 27.11,32.67 27.11,32.83 28.22,31.72 | v56.79,30.77 55.84,31.72
  Bottom 1.27: 21.39,33.78 20.44,32.83
  Bottom 1.905: 27.11,32.83 20.44,32.83 18.15,30.55 DRVER_5.P$8 | 21.39,33.78 v21.39,53.31 v21.39,55.06 v21.39,56.64 | v56.79,22.99 v56.79,25.69 v56.79,28.23 v56.79,30.77 | 48.86,31.72 55.84,31.72 57.59,33.47 81.24,33.47 | 48.86,31.72 47.36,30.23 DRVER_4.P$8 | v26,31.56 v26,29.02 v26,26.48 v26,23.94 | v88.23,24.9 v88.23,27.44 v88.23,29.98 v88.23,32.52 87.27,33.47 81.24,33.47 | 81.24,33.47 79.75,31.98 DRVER_6.P$8 | 48.86,31.72 28.22,31.72
VLOGIC  (via drill 0.35)
  Top 0.203: v56.48,66.81 56.19,66.52 U1.80
  Top 0.254: U1.31 48.69,54.73
  Top 0.305: CN1.VBUS 85.2,67.75 v84.26,66.81 | C12.1 C13.1 v81.08,69.66 | C12.1 R5.2 v73.78,69.66 | R10.1 R11.1 v85.84,53.15 | R10.1 R8.1 v91.56,53.15 | R10.1 v88.7,53.15 | U2.4 78.91,69.34 v78.86,69.34 | C12.1 77.91,70.94 v76.64,69.67 v76.64,69.66 | v27.9,61.25 | v36.15,61.25 v36.16,61.25 | U2.20 75.68,59.95 v75.68,57.76 | U1.100 43.68,64.01 v42.82,63.15 | U1.61 63.25,55.01 v63.3,55.06 | 48.69,54.73 v49.97,56.01 | U1.10 41.62,57.51 v41.08,56.96
  Top 0.406: C10.1 24.57,53.88 | U$2.4 6.12,50.93 5.52,50.93 | U$2.4 7.42,49.03 | U$2.4 9.93,47.12 | U$2.4 9.93,50.93
  Top 0.508: R9.1 92.51,59.82 | 92.51,59.82 R12.1 | 92.51,59.82 v93.96,59.82
  Top 0.61: LED1.1-VDD 31.17,56.23 30.28,56.23 | R7.2 v37.27,50.93 | v27.9,61.25 R13.1 R14.1 v36.15,61.25 | MS14.2 MS15.2 v5.04,38.23 | MS14.2 MS13.2 v10.12,38.23 | MS14.2 v7.58,38.23 | MS11.2 MS12.2 v33.93,35.85 | MS11.2 MS10.2 v39.81,35.85 | MS11.2 v36.95,35.85 | MS18.2 66.79,36.16 | 66.79,36.16 MS17.2 69.49,36.16 | 69.49,36.16 MS16.2 | 66.79,36.16 v66.79,38.07 | 69.49,36.16 v69.49,38.23 | C11.1 28.22,54.03 | v30.28,57.28 30.28,56.23 | 28.15,54.19 C11.1 | C11.1 30.1,56.23 30.28,56.23
  Top 0.813: U$2.4 5.36,46.36 v5.36,44.74 | U$2.4 5.36,51.69 v5.36,53.47 | U$2.4 10.6,46.45 v10.6,44.74 | U$2.4 10.6,51.6 v10.6,53.47
  Top 1.016: U$2.2 20.12,49.03 21.39,50.3 R1.2 v24.57,52.52 24.57,53.88 | C11.1 C10.1 | 28.22,54.03 v28.22,52.04
  pour Bottom: -1.63,6.21 -1.63,77.35 99.18,77.35 99.18,6.21
VPROG  (via drill 0.35)
  Top 0.305: R7.1 31.55,50.93 v31.23,50.61
  Bottom 0.305: ISP.2 35.36,49.66 34.41,50.61 v31.23,50.61

### Text on the board
tNames: @njhulsey